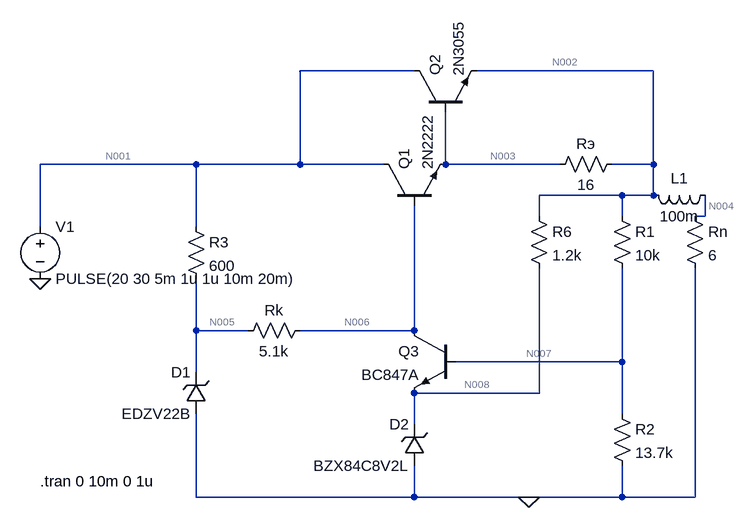
[diagram p0: schematic task3.asc]
task3.asc, the LTspice schematic file:
Version 4.1
SHEET 1 1668 680
WIRE 688 -128 512 -128
WIRE 1056 -128 784 -128
WIRE 352 16 112 16
WIRE 512 16 512 -128
WIRE 512 16 352 16
WIRE 640 16 512 16
WIRE 736 16 736 -64
WIRE 912 16 736 16
WIRE 1056 16 1056 -128
WIRE 1056 16 992 16
WIRE 1008 64 880 64
WIRE 1056 64 1056 16
WIRE 1056 64 1008 64
WIRE 880 96 880 64
WIRE 1008 96 1008 64
WIRE 1136 96 1136 64
WIRE 1136 96 1120 96
WIRE 112 112 112 16
WIRE 352 112 352 16
WIRE 352 272 352 192
WIRE 432 272 352 272
WIRE 688 272 688 80
WIRE 688 272 512 272
WIRE 1008 320 1008 176
WIRE 1008 320 752 320
WIRE 352 336 352 272
WIRE 880 368 880 176
WIRE 880 368 688 368
WIRE 1008 400 1008 320
WIRE 688 416 688 368
WIRE 352 528 352 400
WIRE 688 528 688 480
WIRE 688 528 352 528
WIRE 864 528 688 528
WIRE 1008 528 1008 480
WIRE 1008 528 864 528
WIRE 1120 528 1120 176
WIRE 1120 528 1008 528
FLAG 112 192 0
FLAG 864 528 0
SYMBOL voltage 112 96 R0
WINDOW 123 0 0 Left 0
WINDOW 39 0 0 Left 0
SYMATTR InstName V1
SYMATTR Value PULSE(20 30 5m 1u 1u 10m 20m)
SYMBOL res 336 96 R0
SYMATTR InstName R3
SYMATTR Value 600
SYMBOL res 528 256 R90
WINDOW 0 0 56 VBottom 2
WINDOW 3 32 56 VTop 2
SYMATTR InstName Rk
SYMATTR Value 5.1k
SYMBOL zener 368 400 R180
WINDOW 0 24 64 Left 2
WINDOW 3 24 0 Left 2
SYMATTR InstName D1
SYMATTR Value EDZV22B
SYMBOL npn 640 80 R270
SYMATTR InstName Q1
SYMATTR Value 2N2222
SYMBOL npn 688 -64 R270
SYMATTR InstName Q2
SYMATTR Value 2N3055
SYMBOL res 896 32 R270
WINDOW 0 32 56 VTop 2
WINDOW 3 0 56 VBottom 2
SYMATTR InstName Rэ
SYMATTR Value 16
SYMBOL res 864 80 R0
SYMATTR InstName R6
SYMATTR Value 1.2k
SYMBOL res 992 80 R0
SYMATTR InstName R1
SYMATTR Value 10k
SYMBOL npn 752 272 M0
SYMATTR InstName Q3
SYMATTR Value BC847A
SYMBOL zener 704 480 R180
WINDOW 0 24 64 Left 2
WINDOW 3 24 0 Left 2
SYMATTR InstName D2
SYMATTR Value BZX84C8V2L
SYMBOL res 992 384 R0
SYMATTR InstName R2
SYMATTR Value 13.7k
SYMBOL res 1104 80 R0
SYMATTR InstName Rn
SYMATTR Value 6
SYMBOL ind 1152 48 R90
WINDOW 0 5 56 VBottom 2
WINDOW 3 32 56 VTop 2
SYMATTR InstName L1
SYMATTR Value 100m
SYMATTR SpiceLine Rser=1m
TEXT 112 504 Left 2 !.tran 0 10m 0 1u

The netlist it stands for:
* task3.asc
V1 N001 0 PULSE(20 30 5m 1u 1u 10m 20m)
R3 N001 N005 600
Rk N006 N005 5.1k
D1 0 N005 EDZV22B
Q1 N001 N006 N003 0 2N2222
Q2 N001 N003 N002 0 2N3055
Rэ N003 N002 16
R6 N002 N008 1.2k
R1 N002 N007 10k
Q3 N006 N007 N008 0 BC847A
D2 0 N008 BZX84C8V2L
R2 N007 0 13.7k
Rn N004 0 6
L1 N004 N002 100m Rser=1m
.model D D
.lib standard.dio
.model NPN NPN
.model PNP PNP
.lib standard.bjt
.tran 0 10m 0 1u
.backanno
.end

* Results of the author's LTspice run, read from the files saved beside the schematic
* Operating Point, zero values left out:
*   V(n001) = 20 V
*   V(n002) = 13.68 V
*   V(n003) = 14.26 V
*   V(n004) = 13.67 V
*   V(n005) = 19.48 V
*   V(n006) = 15.08 V
*   V(n007) = 7.906 V
*   V(n008) = 8.318 V
*   I(D1) = -22.72 pA
*   I(D2) = -4.465 mA
*   I(L1) = -2.279 A
*   I(R1) = 577 µA
*   I(R2) = 577 µA
*   I(R3) = 863.2 µA
*   I(R6) = 4.465 mA
*   I(Rk) = -863.2 µA
*   I(Rn) = 2.279 A
*   I(Rэ) = 36.31 mA
*   I(V1) = -2.284 A
*   Ib(Q1) = 863.2 µA
*   Ib(Q2) = 93.11 mA
*   Ib(Q3) = -12.83 pA
*   Ic(Q1) = 128.6 mA
*   Ic(Q2) = 2.155 A
*   Ic(Q3) = 12.41 pA
*   Ie(Q1) = -129.4 mA
*   Ie(Q2) = -2.248 A
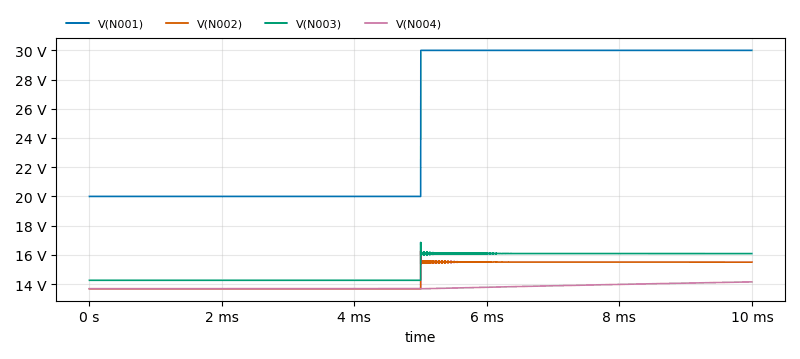
[diagram p1: Transient Analysis of task3.asc, plotted from the saved traces]
* Transient Analysis, 1 run:
*   V(N001): min 20 V, max 30 V, average 25 V, rms 25.49 V, last 30 V
*   V(N002): min 13.68 V, max 16.27 V, average 14.59 V, rms 14.62 V, last 15.5 V
*   V(N003): min 14.26 V, max 16.85 V, average 15.17 V, rms 15.2 V, last 16.08 V
*   V(N004): min 13.67 V, max 14.15 V, average 13.8 V, rms 13.8 V, last 14.15 V